# EAGLE design USB-RS485_ConversionAdapter_ver2_1 (EAGLE 9.6.2)
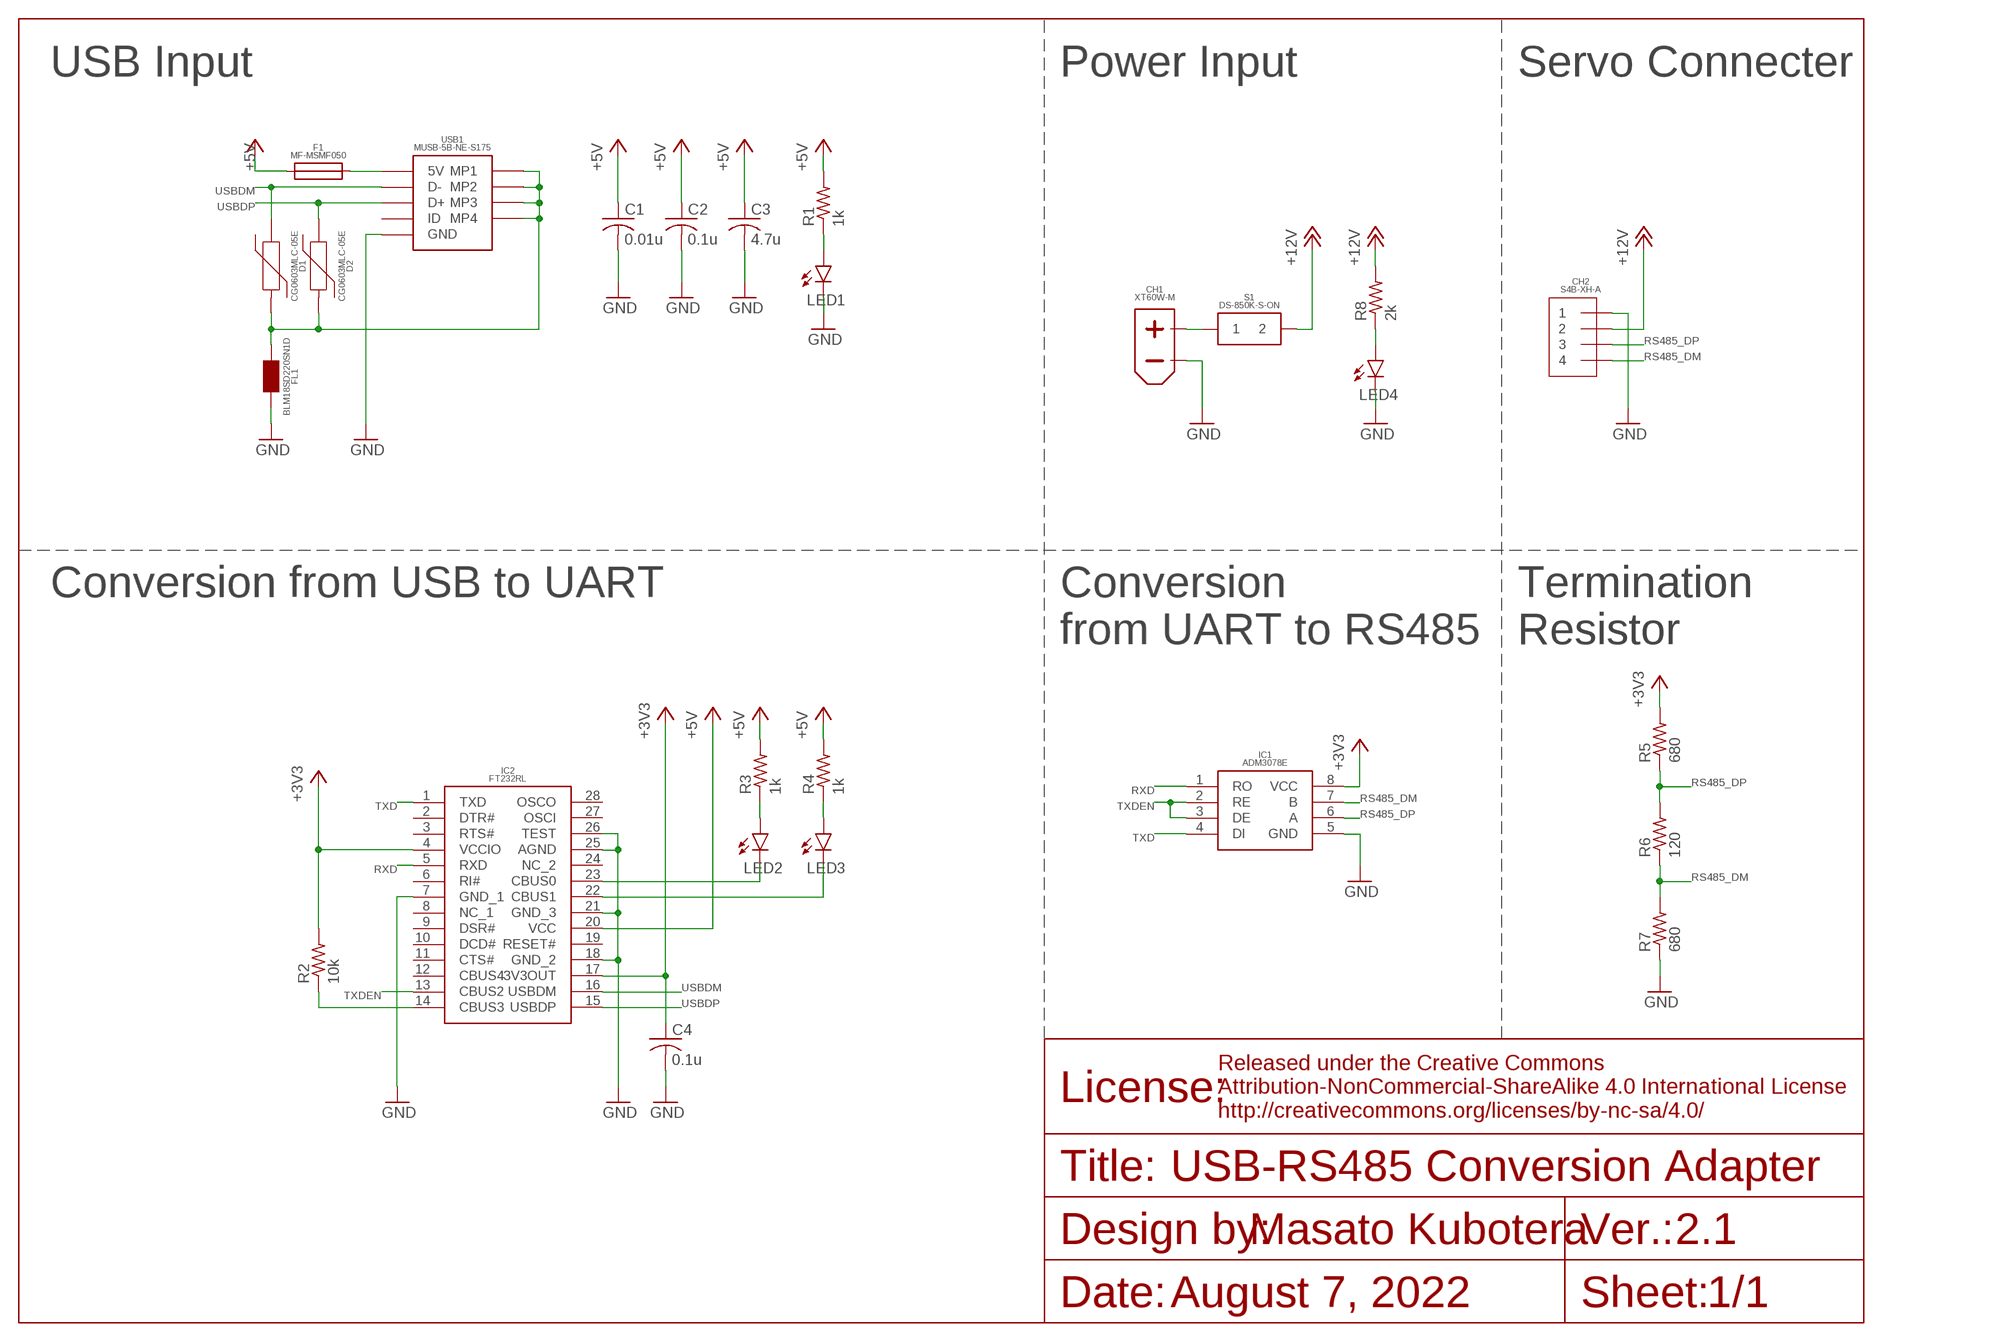
[diagram p0: schematic, sheet 1]

## Parts
C1  0.01u  C-USC0603  [C0603]
C2  0.1u  C-USC0603  [C0603]
C3  4.7u  C-USC0603  [C0603]
C4  0.1u  C-USC0603  [C0603]
CH1  XT60PW-M  [XT60PW-M]
CH2  S4B-XH-A  [S4B-XH-A]
D1  CG0603MLC-05E  [CG0603MLC-05E]
D2  CG0603MLC-05E  [CG0603MLC-05E]
F1  MF-MSMF050  [MF-MSMF050]
FL1  BLM18SD220SN1D  [BLM18SD220SN1D]
IC1  ADM3078E  [ADM3078E]
IC2  FT232RL  [FT232RL]
LED1  LEDSML0603  [SML0603]
LED2  LEDSML0603  [SML0603]
LED3  LEDSML0603  [SML0603]
LED4  LEDSML0603  [SML0603]
R1  1k  R-US_R0603  [R0603]
R2  10k  R-US_R0603  [R0603]
R3  1k  R-US_R0603  [R0603]
R4  1k  R-US_R0603  [R0603]
R5  680  R-US_R0603  [R0603]
R6  120  R-US_R0603  [R0603]
R7  680  R-US_R0603  [R0603]
R8  2k  R-US_R0603  [R0603]
S1  DS-850K-S-ON  [DS-850K-S-ON]
USB1  MINI_USB_B_SMD  [MINI_USB_B_SMD]

## Nets
5V_LED: LED1.A R1.1
12V_LED: LED4.A R8.1
+3V3: C4.1 IC1.8(VCC) IC2.4(VCCIO) IC2.17(3V3OUT) R2.2 R5.2
+5V: C1.1 C2.1 C3.1 F1.1 IC2.20(VCC) R1.2 R3.2 R4.2
+12V: CH2.2 R8.2 S1.2B S1.2T
B_FUSE_USB_MINI_B [USB-Power]: F1.2 USB1.1(5V)
BEFORE_+12V: CH1.+ S1.1B S1.1T
CBUS0: IC2.23(CBUS0) LED2.C
CBUS1: IC2.22(CBUS1) LED3.C
CBUS3: IC2.14(CBUS3) R2.1
GND: C1.2 C2.2 C3.2 C4.2 CH1.- CH2.1 FL1.2 IC1.5(GND) IC2.7(GND_1) IC2.18(GND_2) IC2.21(GND_3) IC2.25(AGND) IC2.26(TEST) LED1.C LED4.C R7.1 USB1.5(GND)
RS485_DM: CH2.4 IC1.7(B) R6.1 R7.2
RS485_DP: CH2.3 IC1.6(A) R5.1 R6.2
RXD: IC1.1(RO) IC2.5(RXD)
RXLED#: LED3.A R4.1
TXD: IC1.4(DI) IC2.1(TXD)
TXDEN: IC1.2(RE) IC1.3(DE) IC2.13(CBUS2)
TXLED#: LED2.A R3.1
USB_MINI_B_SHIELD [USB-Power]: D1.2 D2.2 FL1.1 USB1.MP1 USB1.MP2 USB1.MP3 USB1.MP4
USBDM: D1.1 IC2.16(USBDM) USB1.2(D-)
USBDP: D2.1 IC2.15(USBDP) USB1.3(D+)
Unconnected: IC2.2(DTR#) IC2.3(RTS#) IC2.6(RI#) IC2.8(NC_1) IC2.9(DSR#) IC2.10(DCD#) IC2.11(CTS#) IC2.12(CBUS4) IC2.19(RESET#) IC2.24(NC_2) IC2.27(OSCI) IC2.28(OSCO) USB1.4(ID)

## Notes on the sheet
- USB Input | Power Input | Servo Connecter
- Conversion from USB to UART
- Conversion
  from UART to RS485
- Termination
  Resistor
- USB-RS485 Conversion Adapter
- 2.1
- August 7, 2022 | 1/1

## Library data of the parts
C1-C4 = rcl:C-US: CAPACITOR, American symbol; SPICEPREFIX: C
CH1 = AMASS_XT60:XT60PW-M
CH2 = JST-XH:S4B-XH-A
D1 D2 = CG0603MLC-05E:CG0603MLC-05E
F1 = MF-MSMF:MF-MSMF050
FL1 = BLM18SD220SN1D:BLM18SD220SN1D
IC1 = ADM3078E:ADM3078E
IC2 = FT232RL:FT232RL
LED1-LED4 = led:LED: LED OSRAM: - CHIPLED LG R971, LG N971, LY N971, LG Q971, LY Q971, LO R971, LY R971 LH N974, LH R974 LS Q976, LO Q976, LY Q976 LO Q996 - Hyper CHIPLED LW Q18S LB Q993, LB Q99A, LB R99A - SideLED LS A670, LO A670, LY A670, LG A670, LP A670 LB A673, LV A673, LT A673, LW A673 LH A674 LY A675 LS A676, LA A676, LO A676, LY A676, LW A676 LS A679, LY A679, LG A679 - Hyper Micro SIDELED® LS Y876, LA Y876, LO Y876, LY Y876 LT Y87S - SmartLED LW L88C, LW L88S LB L89C, LB L89S, LG L890 LS L89K, LO L89K, LY L89K LS L896, LA L896, LO L896, LY L896 - TOPLED LS T670, LO T670, LY T670, LG T670, LP T670 LSG T670, LSP T670, LSY T670, LOP T670, LYG T670 LG T671, LOG T671, LSG T671 LB T673, LV T673, LT T673, LW T673 LH T674 LS T676, LA T676, LO T676, LY T676, LB T676, LH T676, LSB T676, LW T676 LB T67C, LV T67C, LT T67C, LS T67K, LO T67K, LY T67K, LW E67C LS E67B, LA E67B, LO E67B, LY E67B, LB E67C, LV E67C, LT E67C LW T67C LS T679, LY T679, LG T679 LS T770, LO T770, LY T770, LG T770, LP T770 LB T773, LV T773, LT T773, LW T773 LH T774 LS E675, LA E675, LY E675, LS T675 LS T776, LA T776, LO T776, LY T776, LB T776 LHGB T686 LT T68C, LB T68C - Hyper Mini TOPLED® LB M676 - Mini TOPLED Santana® LG M470 LS M47K, LO M47K, LY M47K Source: http://www.osram.convergy.de LUXEON: - LUMILED® LXK2-PW12-R00, LXK2-PW12-S00, LXK2-PW14-U00, LXK2-PW14-V00 LXK2-PM12-R00, LXK2-PM12-S00, LXK2-PM14-U00 LXK2-PE12-Q00, LXK2-PE12-R00, LXK2-PE12-S00, LXK2-PE14-T00, LXK2-PE14-U00 LXK2-PB12-K00, LXK2-PB12-L00, LXK2-PB12-M00, LXK2-PB14-N00, LXK2-PB14-P00, LXK2-PB14-Q00 LXK2-PR12-L00, LXK2-PR12-M00, LXK2-PR14-Q00, LXK2-PR14-R00 LXK2-PD12-Q00, LXK2-PD12-R00, LXK2-PD12-S00 LXK2-PH12-R00, LXK2-PH12-S00 LXK2-PL12-P00, LXK2-PL12-Q00, LXK2-PL12-R00 Source: www.luxeon.com KINGBRIGHT: KA-3528ASYC Source: www.kingbright.com
R1-R8 = rcl:R-US_: RESISTOR, American symbol; SPICEPREFIX: R
S1 = DS-850K-S-ON:DS-850K-S-ON
USB1 = USB_Connector:MINI_USB_B_SMD

## Net classes
1 USB-Data: width 0.254 mm, drill 0.127 mm, clearance 0.203 mm
2 USB-Power: width 0.254 mm, drill 0.127 mm, clearance 0.203 mm

## Board
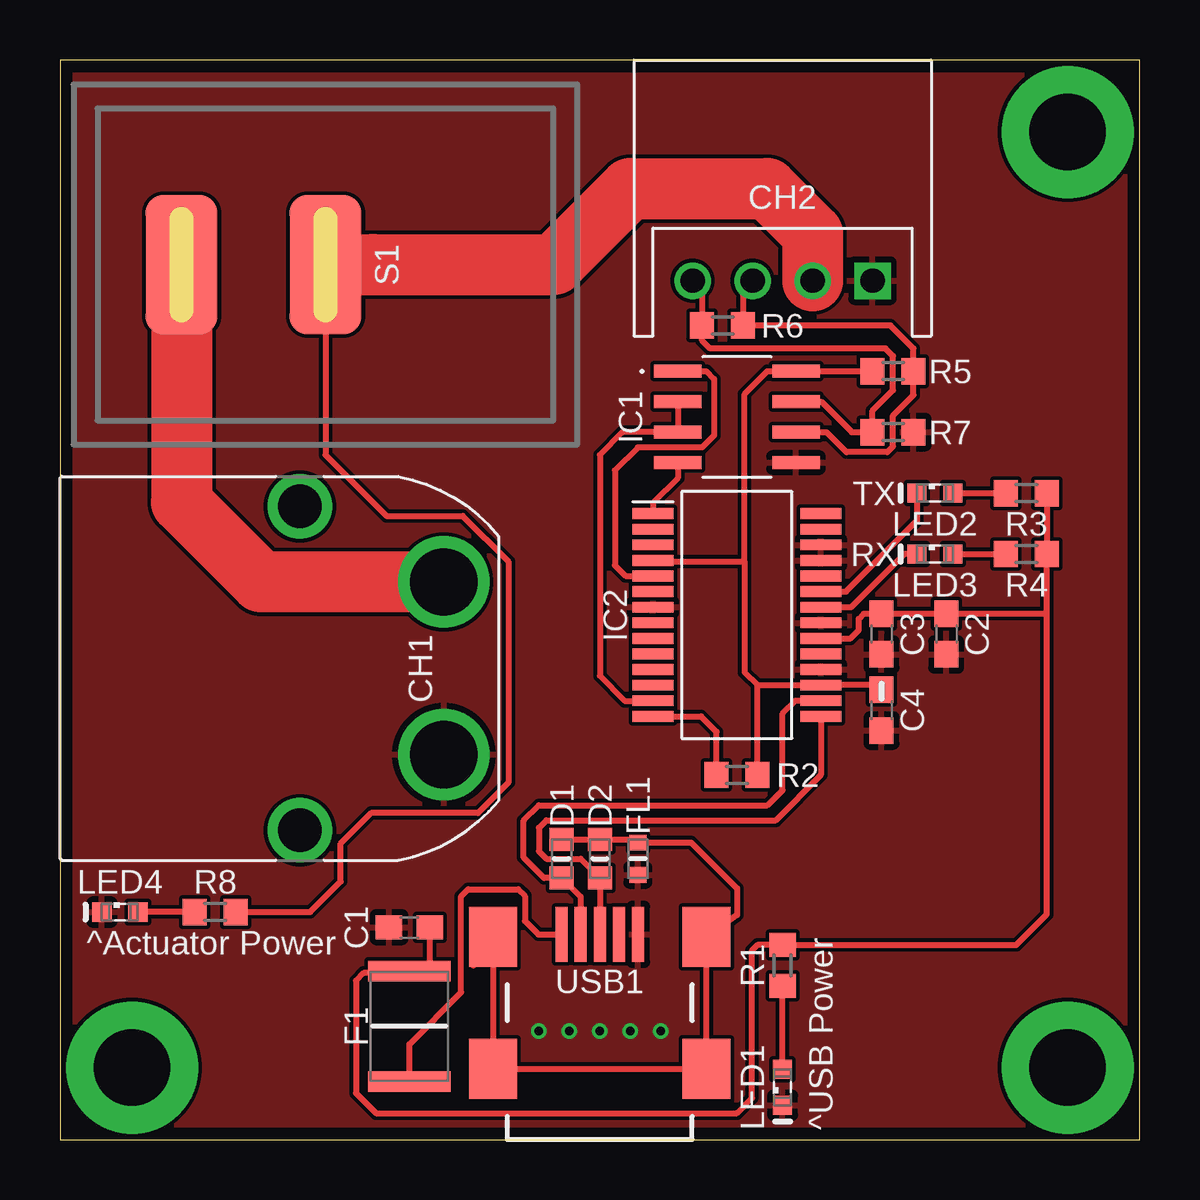
[diagram p1: board, top side]
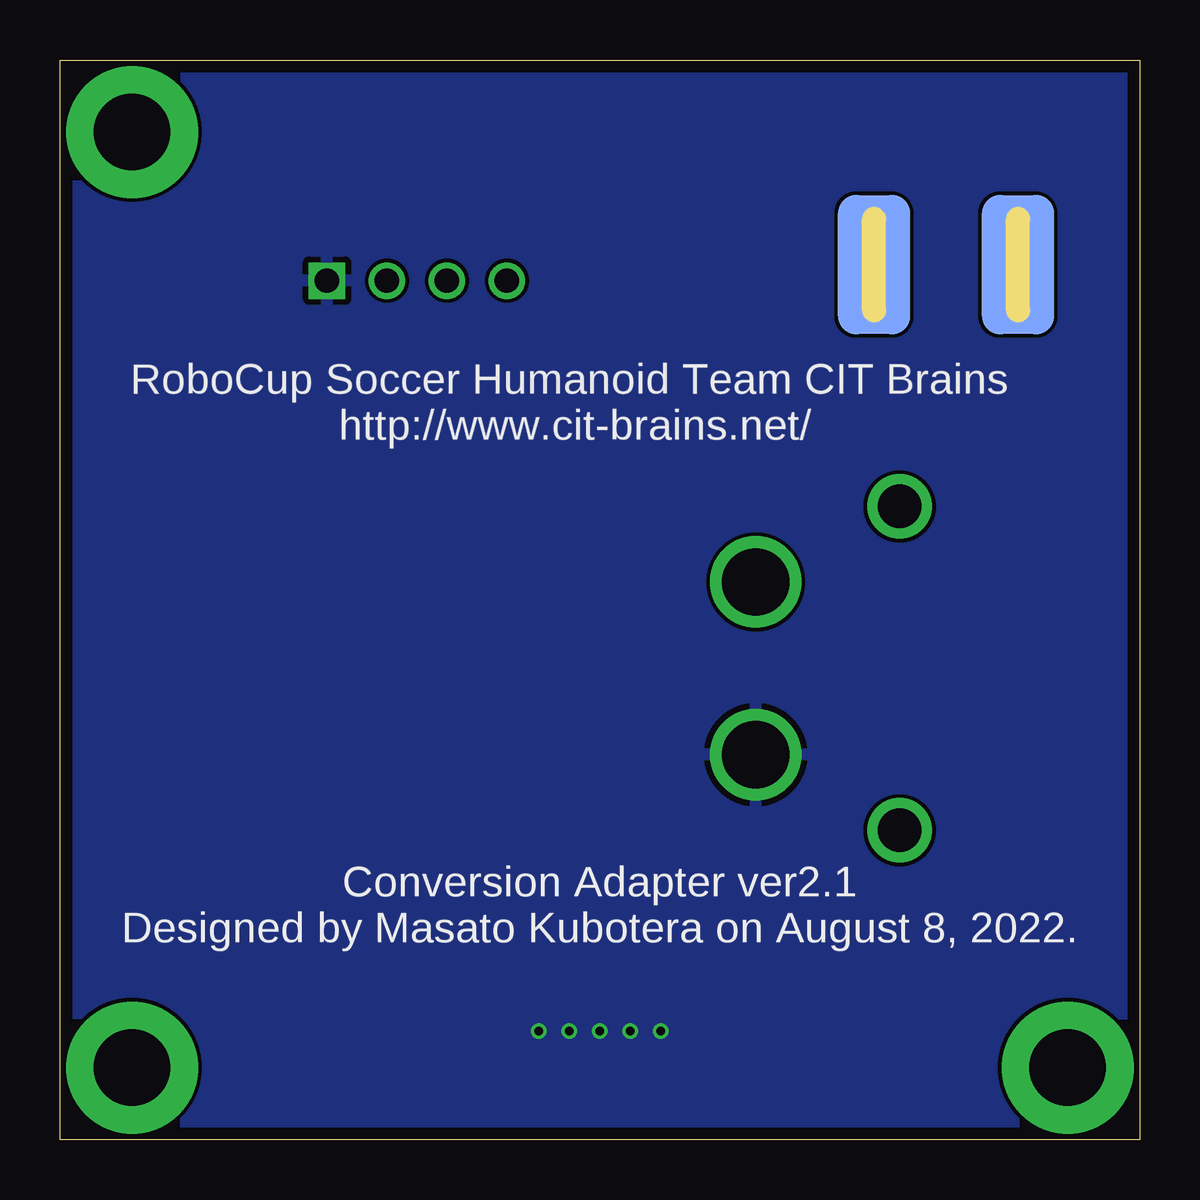
[diagram p2: board, bottom side, seen from below]

Size 45 x 45 mm. Coordinates in mm from the lower left corner, seen from the top.
Outline: 0,0 45,0 45,45 0,45 0,0
Copper layers (1*16): Top 0.035mm / dielectric 1.6mm / Bottom 0.035mm
Design rules "Elecrow_2-layer_PCB_eagle_rule": minimum track width 6mil, minimum drill 12mil, track to track 6mil, track to pad 6mil, pad to pad 6mil, via to via 8mil, smd to smd 0mil, copper to edge 20mil, drill to drill 10mil, minimum pad ring 6mil, minimum via ring 6mil, stop-mask expansion 0mil, vias tented up to drill 100mil, thermal gap 10mil

### Footprints (pad centres in the part's own frame; a part is rotated, then mirrored left to right if it is on the bottom)
C0603 = smd 1.1 x 1: 1 -0.85,0; 2 0.85,0
XT60PW-M = drill 1.8: 1 -6.75,-10; 2 6.75,-10 | drill 2.8: + 3.6,-16; - -3.6,-16
S4B-XH-A = drill 1.016 square: 1 3.75,0 | drill 1.016: 2 1.25,0; 3 -1.25,0; 4 -3.75,0
CG0603MLC-05E = smd 0.95 x 1: 1 -0.8,0; 2 0.8,0
MF-MSMF050 = smd 0.85 x 3.43: 1 -2.3,0; 2 2.3,0
BLM18SD220SN1D = smd 0.65 x 0.7: 1 -0.675,0; 2 0.675,0
ADM3078E = smd 1.981 x 0.533: 1 -2.464,1.905; 2 -2.464,0.635; 3 -2.464,-0.635; 4 -2.464,-1.905; 5 2.464,-1.905; 6 2.464,-0.635; 7 2.464,0.635; 8 2.464,1.905
FT232RL = smd 1.7 x 0.45: 1 -3.5,4.225; 2 -3.5,3.575; 3 -3.5,2.925; 4 -3.5,2.275; 5 -3.5,1.625; 6 -3.5,0.975; 7 -3.5,0.325; 8 -3.5,-0.325; 9 -3.5,-0.975; 10 -3.5,-1.625; 11 -3.5,-2.275; 12 -3.5,-2.925; 13 -3.5,-3.575; 14 -3.5,-4.225; 15 3.5,-4.225; 16 3.5,-3.575; 17 3.5,-2.925; 18 3.5,-2.275; 19 3.5,-1.625; 20 3.5,-0.975; 21 3.5,-0.325; 22 3.5,0.325; 23 3.5,0.975; 24 3.5,1.625; 25 3.5,2.275; 26 3.5,2.925; 27 3.5,3.575; 28 3.5,4.225
SML0603 = smd 0.8 x 0.8: A 0.75,0; C -0.75,0
R0603 = smd 1 x 1.1: 1 -0.85,0; 2 0.85,0
DS-850K-S-ON = smd 5.8 x 3 bottom: 1B 0,6; 2B 0,0 | smd 5.8 x 3: 1T 0,6; 2T 0,0
MINI_USB_B_SMD = smd 0.5 x 2.3: 1 -1.6,8.55; 2 -0.8,8.55; 3 0,8.55; 4 0.8,8.55; 5 1.6,8.55 | smd 2 x 2.5: MP1 -4.45,8.45; MP2 4.45,8.45; MP3 4.45,2.95; MP4 -4.45,2.95

### Placement (x,y rotation side)
C1  14.56,8.85 180 top
C2  36.95,21.07 270 top
C3  34.25,21.07 270 top
C4  34.25,17.9 270 top
CH1  0,19.64 90 top
CH2  30.12,35.8 0 top
D1  20.91,11.71 90 top
D2  22.5,11.71 90 top
F1  14.56,4.72 270 top
FL1  24.09,11.71 270 top
IC1  28.21,30.12 0 top
IC2  28.21,21.86 0 top
LED1  30.12,2.18 90 top
LED2  36.47,26.95 0 top
LED3  36.47,24.41 0 top
LED4  2.5,9.48 0 top
R1  30.12,7.26 90 top
R2  28.21,15.2 0 top
R3  40.28,26.95 0 top
R4  40.28,24.41 0 top
R5  34.72,32.02 180 top
R6  27.62,33.93 0 top
R7  34.72,29.48 180 top
R8  6.47,9.48 0 top
S1  11.07,36.47 90 top
USB1  22.5,0 0 top

### Tracks (layer width: path | path; a pad name or v marks a point on that pad's centre or on a via)
5V_LED
  Top 0.254: LED1.A R1.1
12V_LED
  Top 0.254: R8.1 LED4.A
+3V3
  Top 0.152: 30.12,32.02 IC1.8
  Top 0.254: C4.1 34.05,18.94 IC2.17 29.07,18.94 | 30.12,32.02 29.48,32.02 28.53,31.07 28.53,24.09 | IC2.4 24.77,24.09 28.53,24.09 | R2.2 29.07,18.94 | 29.07,18.94 28.53,19.47 28.53,24.09 | IC1.8 R5.2
+5V
  Top 0.254: 14.32,7.02 F1.1 15.12,7.02 15.2,6.94 | IC2.20 32.95,20.89 33.3,21.23 33.3,21.71 33.51,21.92 C3.1 C2.1 41.13,21.92 | R3.2 R4.2 41.13,21.92 | 41.13,21.92 41.13,9.38 39.86,8.11 R1.2 29.07,8.11 28.85,7.89 28.85,1.73 28.21,1.1 13.17,1.1 12.34,1.93 12.34,6.62 12.66,6.94 15.2,6.94 | C1.1 15.41,7.16 15.2,6.94
+12V  (1 unrouted)
  Top 0.152: 13.05,36.52 13.05,36.47
  Top 0.254: S1.2T 11.07,28.53 13.61,25.99 16.79,25.99 18.69,24.09 18.69,14.88 17.42,13.61 12.97,13.61 11.71,12.34 11.71,10.75 10.44,9.48 R8.2
  Top 2.54: S1.2T 13.05,36.47 20.59,36.47 23.77,39.64 29.48,39.64 31.37,37.76 CH2.2
  Bottom 0.152: 11.07,36.52 S1.2T
B_FUSE_USB_MINI_B
  Top 0.254: F1.2 14.56,3.98 16.72,6.14 16.72,10.14 17.01,10.44 19.1,10.44 19.38,10.15 19.38,9.11 19.94,8.55 USB1.1 20.78,8.19
BEFORE_+12V  (1 unrouted)
  Top 0.152: 6.27,36.52 S1.1T
  Top 2.54: S1.1T 5.07,26.55 8.38,23.24 CH1.+
  Bottom 0.152: 5.13,36.52 S1.1T
CBUS0
  Top 0.254: IC2.23 32.77,22.84 35.72,25.79 LED2.C
CBUS1
  Top 0.254: LED3.C 35.2,24.41 32.98,22.19 IC2.22
CBUS3
  Top 0.254: IC2.14 26.73,17.64 27.37,17 R2.1
GND  (via drill 0.35)
  other vias: 19.96,4.52 21.23,4.52 22.5,4.52 23.77,4.52 25.04,4.52
  pour Top: -2.9,47.9 -2.9,-2.9 47.9,-2.9 47.9,47.9
  pour Bottom: -1.63,46.63 -1.63,-1.63 46.63,-1.63 46.63,46.63
HOLE1  (via drill 3.2 pad 5.5)
  other vias: 3,3
HOLE2  (via drill 3.2 pad 5.5)
  other vias: 42,3
HOLE3  (via drill 3.2 pad 5.5)
  other vias: 42,42
RS485_DM
  Top 0.254: CH2.4 26.77,35.4 R6.1 26.77,33.31 27.1,32.98 34.41,32.98 34.72,32.66 34.72,31.23 33.87,30.38 R7.2 33,29.48 31.73,30.76 IC1.7
RS485_DP
  Top 0.254: CH2.3 28.47,35.4 R6.2 34.62,33.93 35.57,32.98 R5.1 35.57,31.04 34.72,30.19 34.72,28.89 34.49,28.66 32.78,28.66 31.95,29.48 IC1.6
RXD
  Top 0.254: IC1.1 26.95,32.02 27.26,31.71 27.26,29.34 26.77,28.85 24.09,28.85 23.14,27.9 23.14,23.93 23.58,23.49 IC2.5
RXLED#
  Top 0.254: LED3.A R4.1
TXD
  Top 0.254: IC1.4 25.75,27.58 24.71,26.54 IC2.1
TXDEN
  Top 0.254: IC1.2 IC1.3 23.45,29.48 22.5,28.53 22.5,19.32 23.54,18.29 IC2.13
TXLED#
  Top 0.254: LED2.A R3.1
USB_MINI_B_SHIELD
  Top 0.254: 17.22,7.26 USB1.MP1 USB1.MP4 USB1.MP3 USB1.MP2 28.22,9.36 28.22,10.47 26.31,12.38 FL1.1 23.96,12.51 D2.2 D1.2
USBDM
  Top 0.254: IC2.16 30.66,18.29 30.12,17.75 30.12,14.56 29.48,13.93 19.96,13.93 19.32,13.29 19.32,11.76 20.18,10.9 D1.1 21.7,10.12 USB1.2
USBDP
  Top 0.254: USB1.3 D2.1 21.7,11.7 20.28,11.7 19.96,12.02 19.96,12.99 20.28,13.31 29.84,13.31 31.71,15.19 IC2.15

### Text on the board
tPlace: TX | RX | ^Actuator Power | ^USB Power
bPlace: RoboCup Soccer Humanoid Team CIT Brains / http://www.cit-brains.net/ | Conversion Adapter ver2.1 / Designed by Masato Kubotera on August 8, 2022.